# EAGLE schematic bc-tag-nfc (EAGLE 7.6.0)
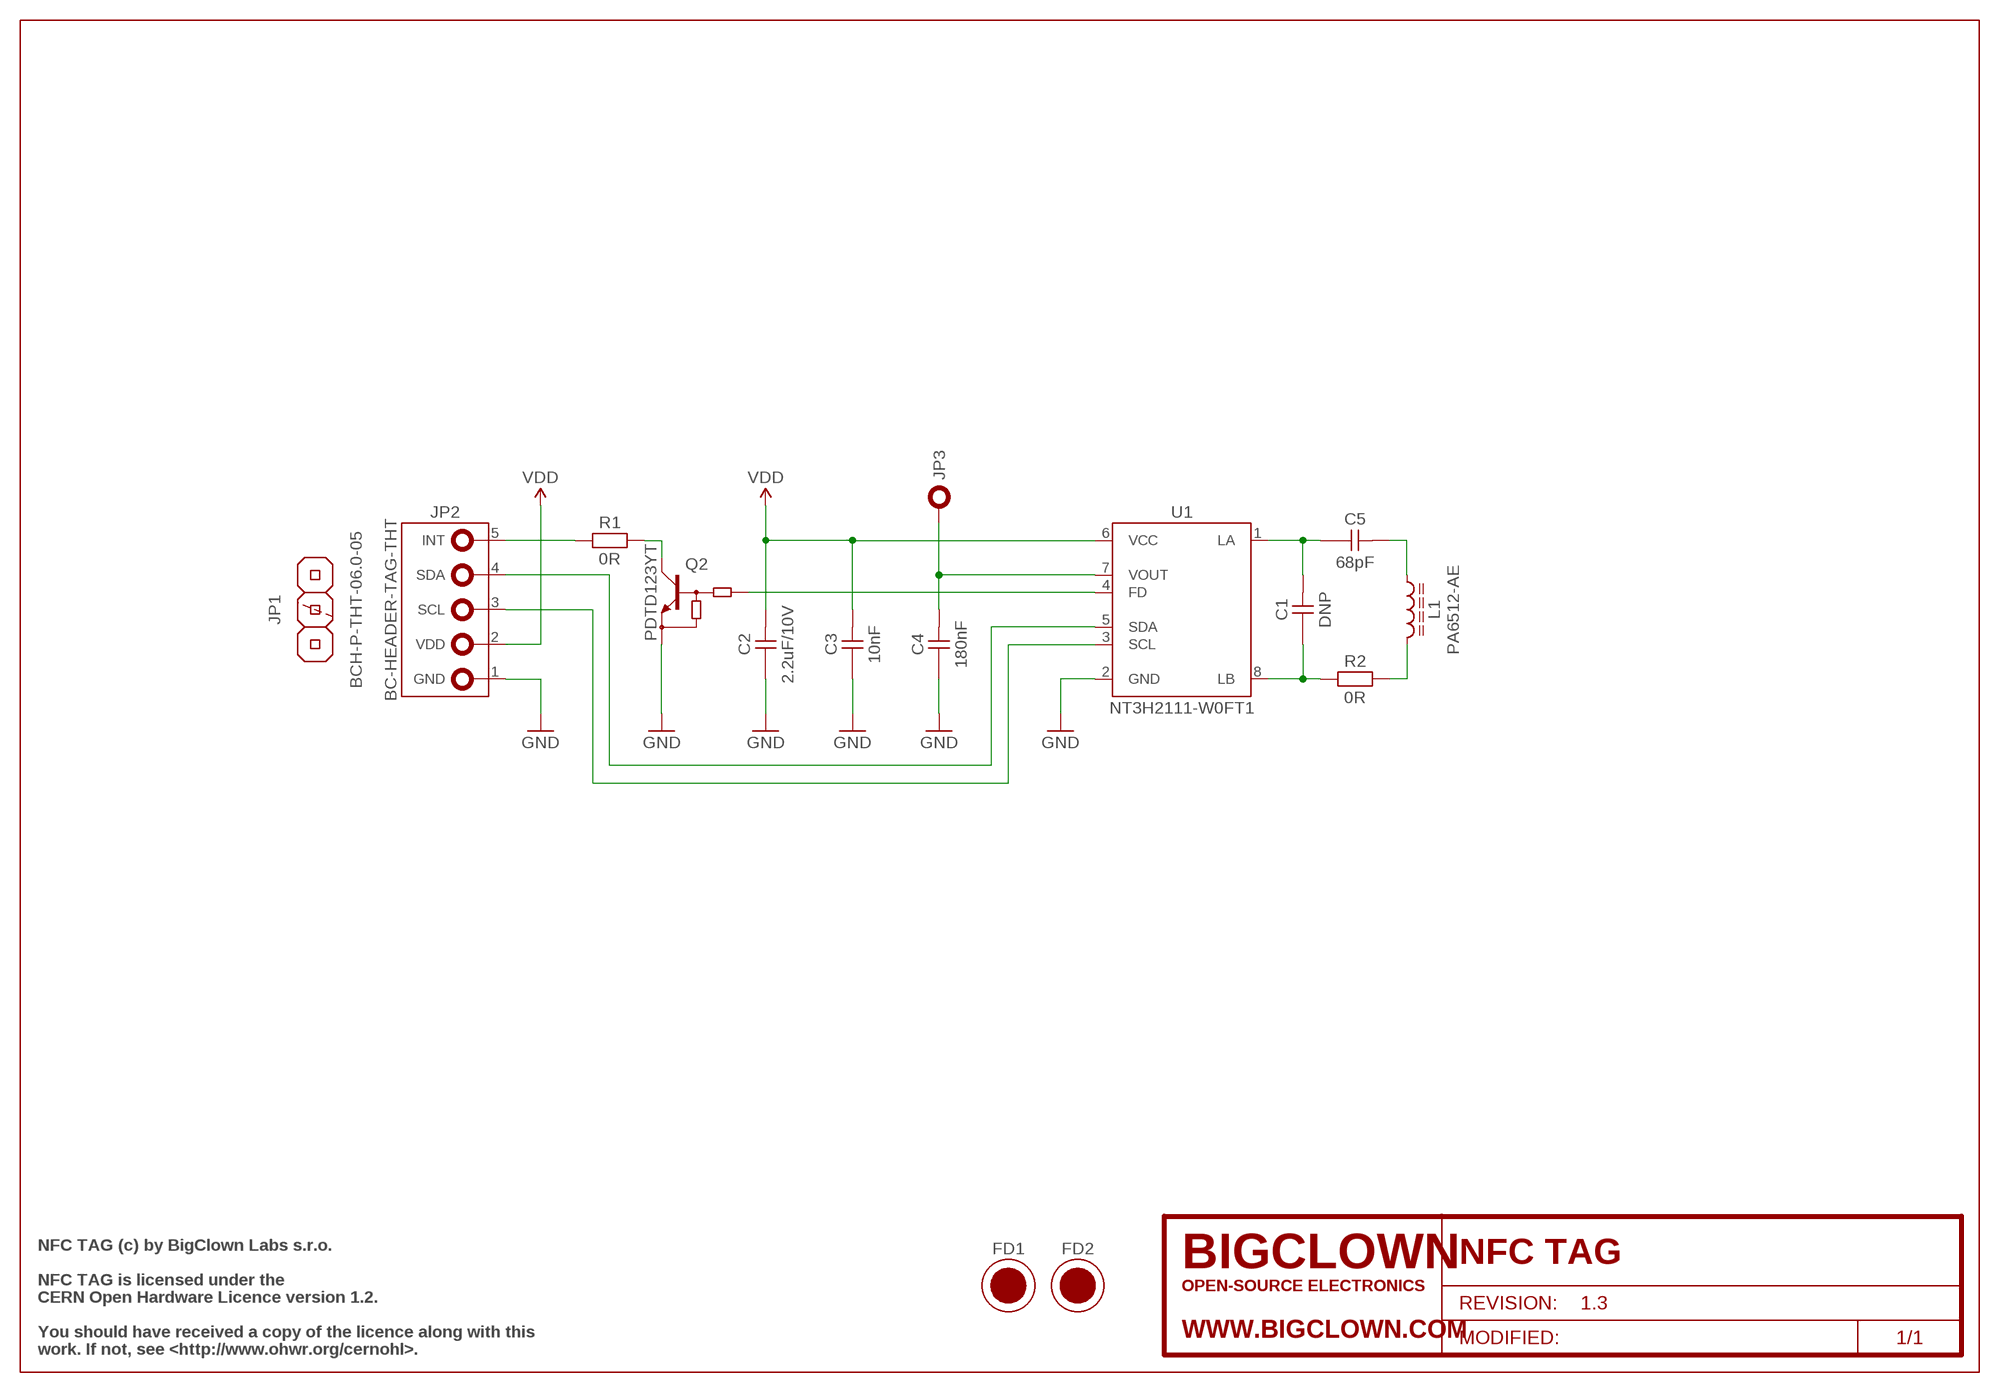
[diagram p0: schematic, sheet 1]

## Parts
C1  DNP  C-0805-DNP  [CAPACITOR-0805_R]
C2  2.2uF/10V  C-0805-2.2UF-10V  [CAPACITOR-0805_R]
C3  10nF  C-0805-10NF  [CAPACITOR-0805_R]
C4  180nF  C-0805-180NF  [CAPACITOR-0805_R]
C5  68pF  C-0805-68PF  [CAPACITOR-0805_R]
FD1  FIDUCIAL  [FIDUCIAL-1MM]
FD2  FIDUCIAL  [FIDUCIAL-1MM]
FRAME1  FRAME-SCH/A4L-BRD/A4L  [FRAME-A4L]
JP1  BCH-P-THT-06.0-05  JP-BCH-P-THT-06.0-05  [BCH-P-THT-05]
JP2  BC-HEADER-TAG-THT  [BC-HEADER-TAG-THT]
JP3  BC-HEADER-PIN-THT  [BC-HEADER-PIN-THT]
L1  PA6512-AE  L-PA6512-AE  [PA6512-AE_R]
Q2  PDTD123YT  Q-PDTD123YT  [SOT-23_R]
R1  0R  R-0805-0R  [RESISTOR-0805_R]
R2  0R  R-0805-0R  [RESISTOR-0805_R]
U1  NT3H2111-W0FT1  U-NT3H2111-W0FT1  [NT3H2111-W0FT1_R]

## Nets
FD: Q2.1(B) U1.4(FD)
FD#: Q2.3(C) R1.2
GND: C2.2 C3.2 C4.2 JP2.1(GND) Q2.2(E) U1.2(GND)
INT: JP2.5(INT) R1.1
L1: C5.1 L1.1
L2: L1.2 R2.2
LA: C1.1 C5.2 U1.1(LA)
LB: C1.2 R2.1 U1.8(LB)
SCL: JP2.3(SCL) U1.3(SCL)
SDA: JP2.4(SDA) U1.5(SDA)
VDD: C2.1 C3.1 JP2.2(VDD) U1.6(VCC)
VOUT: C4.1 JP3.0 U1.7(VOUT)

## Notes on the sheet
- NFC TAG (c) by BigClown Labs s.r.o.
- NFC TAG is licensed under the
- CERN Open Hardware Licence version 1.2.
- You should have received a copy of the licence along with this
- work. If not, see <http://www.ohwr.org/cernohl>.

## Library data of the parts
C1 = bc-capacitor:C-0805-DNP; BCPN: -
C2 = bc-capacitor:C-0805-2.2UF-10V; BCPN: BC-C-0805-2.2UF-10V
C3 = bc-capacitor:C-0805-10NF; BCPN: BC-C-0805-10NF
C4 = bc-capacitor:C-0805-180NF; BCPN: BC-C-0805-180NF
C5 = bc-capacitor:C-0805-68PF; BCPN: BC-C-0805-68PF
FD1 FD2 = bc-fiducial:FIDUCIAL; BCPN: -
FRAME1 = bc-frame:FRAME-SCH/A4L-BRD/A4L; BCPN: -; PROJECT_NAME: NFC TAG; PROJECT_REVISION: 1.3
JP1 = bc-header:JP-BCH-P-THT-06.0-05; BCPN: BC-JP-BCH-P-THT-06.0-05
JP2 = bc-header:BC-HEADER-TAG-THT; BCPN: -
JP3 = bc-header:BC-HEADER-PIN-THT; BCPN: -
L1 = bc-inductor:L-PA6512-AE; BCPN: BC-L-PA6512-AE
Q2 = bc-discrete:Q-PDTD123YT; BCPN: BC-Q-PDTD123YT
R1 R2 = bc-resistor:R-0805-0R; BCPN: BC-R-0805-0R
U1 = bc-memory:U-NT3H2111-W0FT1; BCPN: BC-U-NT3H2111-W0FT1